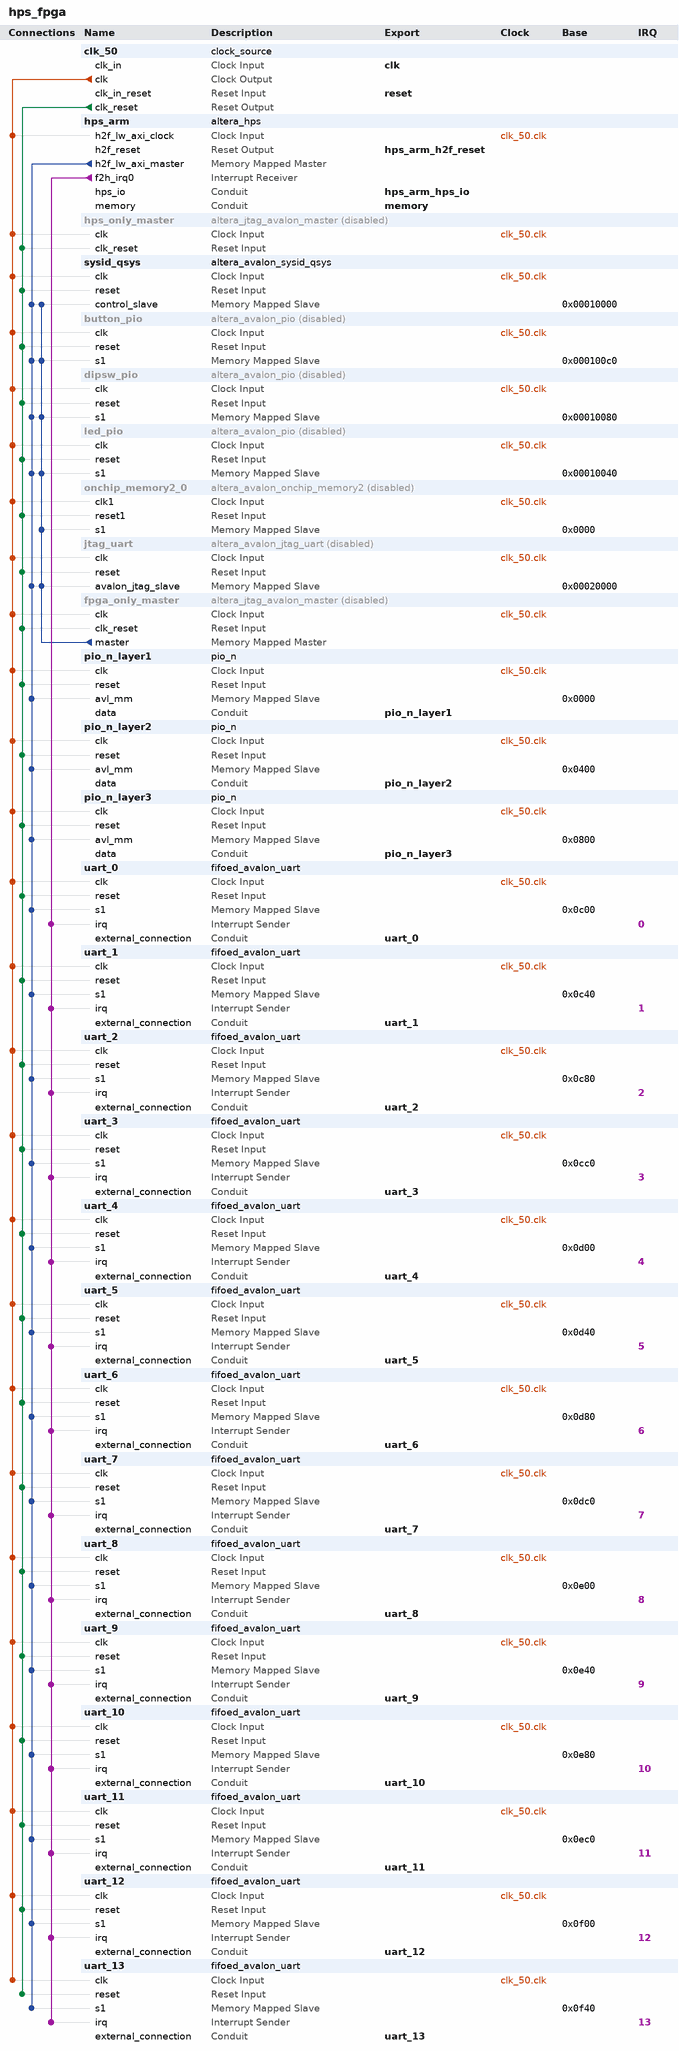
[diagram p0: system contents]
# Platform Designer (Qsys) system hps_fpga, Cyclone V 5CSEBA6U23I7
# Parameters at their usual value, and those the tool derives, are not listed.
package require -exact qsys 16.1
create_system hps_fpga
set_project_property DEVICE_FAMILY {Cyclone V}
set_project_property DEVICE 5CSEBA6U23I7

add_instance clk_50 clock_source 16.1
set_instance_parameter_value clk_50 clockFrequency 50000000

add_instance hps_arm altera_hps 16.1
set_instance_parameter_value hps_arm EMAC1_Mode RGMII
set_instance_parameter_value hps_arm EMAC1_PinMuxing {HPS I/O Set 0}
set_instance_parameter_value hps_arm F2SCLK_COLDRST_Enable false
set_instance_parameter_value hps_arm F2SCLK_DBGRST_Enable false
set_instance_parameter_value hps_arm F2SCLK_WARMRST_Enable false
set_instance_parameter_value hps_arm F2SINTERRUPT_Enable true
set_instance_parameter_value hps_arm F2S_Width 0
set_instance_parameter_value hps_arm FPGA_PERIPHERAL_OUTPUT_CLOCK_FREQ_EMAC0_GTX_CLK 100
set_instance_parameter_value hps_arm FPGA_PERIPHERAL_OUTPUT_CLOCK_FREQ_EMAC0_MD_CLK 100.0
set_instance_parameter_value hps_arm FPGA_PERIPHERAL_OUTPUT_CLOCK_FREQ_EMAC1_GTX_CLK 100
set_instance_parameter_value hps_arm FPGA_PERIPHERAL_OUTPUT_CLOCK_FREQ_EMAC1_MD_CLK 100.0
set_instance_parameter_value hps_arm HPS_PROTOCOL DDR3
set_instance_parameter_value hps_arm I2C0_Mode I2C
set_instance_parameter_value hps_arm I2C0_PinMuxing {HPS I/O Set 0}
set_instance_parameter_value hps_arm I2C1_Mode I2C
set_instance_parameter_value hps_arm I2C1_PinMuxing {HPS I/O Set 0}
set_instance_parameter_value hps_arm LWH2F_Enable true
set_instance_parameter_value hps_arm MEM_BANKADDR_WIDTH 3
set_instance_parameter_value hps_arm MEM_CLK_FREQ 400.0
set_instance_parameter_value hps_arm MEM_COL_ADDR_WIDTH 10
set_instance_parameter_value hps_arm MEM_DQ_WIDTH 32
set_instance_parameter_value hps_arm MEM_DRV_STR RZQ/6
set_instance_parameter_value hps_arm MEM_ROW_ADDR_WIDTH 15
set_instance_parameter_value hps_arm MEM_RTT_NOM RZQ/6
set_instance_parameter_value hps_arm MEM_RTT_WR {Dynamic ODT off}
set_instance_parameter_value hps_arm MEM_TCL 7
set_instance_parameter_value hps_arm MEM_TFAW_NS 37.5
set_instance_parameter_value hps_arm MEM_TRAS_NS 35.0
set_instance_parameter_value hps_arm MEM_TRCD_NS 13.75
set_instance_parameter_value hps_arm MEM_TRFC_NS 300.0
set_instance_parameter_value hps_arm MEM_TRP_NS 13.75
set_instance_parameter_value hps_arm MEM_VENDOR Other
set_instance_parameter_value hps_arm MEM_WTCL 7
set_instance_parameter_value hps_arm QSPI_Mode N/A
set_instance_parameter_value hps_arm QSPI_PinMuxing Unused
set_instance_parameter_value hps_arm REF_CLK_FREQ 25.0
set_instance_parameter_value hps_arm S2FCLK_USER2CLK 5
set_instance_parameter_value hps_arm S2F_Width 0
set_instance_parameter_value hps_arm SDIO_Mode {4-bit Data}
set_instance_parameter_value hps_arm SDIO_PinMuxing {HPS I/O Set 0}
set_instance_parameter_value hps_arm SPIM1_Mode {Single Slave Select}
set_instance_parameter_value hps_arm SPIM1_PinMuxing {HPS I/O Set 0}
set_instance_parameter_value hps_arm STM_Enable false
set_instance_parameter_value hps_arm TIMING_BOARD_AC_SKEW 0.02
set_instance_parameter_value hps_arm TIMING_BOARD_AC_TO_CK_SKEW 0.0
set_instance_parameter_value hps_arm TIMING_BOARD_DQ_TO_DQS_SKEW 0.0
set_instance_parameter_value hps_arm TIMING_BOARD_MAX_CK_DELAY 0.6
set_instance_parameter_value hps_arm TIMING_BOARD_MAX_DQS_DELAY 0.6
set_instance_parameter_value hps_arm TIMING_BOARD_SKEW_BETWEEN_DQS 0.02
set_instance_parameter_value hps_arm TIMING_BOARD_SKEW_CKDQS_DIMM_MAX 0.01
set_instance_parameter_value hps_arm TIMING_BOARD_SKEW_CKDQS_DIMM_MIN -0.01
set_instance_parameter_value hps_arm TIMING_BOARD_SKEW_WITHIN_DQS 0.02
set_instance_parameter_value hps_arm TIMING_TDH 125
set_instance_parameter_value hps_arm TIMING_TDQSCK 400
set_instance_parameter_value hps_arm TIMING_TDQSQ 120
set_instance_parameter_value hps_arm TIMING_TDS 50
set_instance_parameter_value hps_arm TIMING_TIH 250
set_instance_parameter_value hps_arm TIMING_TIS 175
set_instance_parameter_value hps_arm TIMING_TQSH 0.38
set_instance_parameter_value hps_arm UART0_Mode {No Flow Control}
set_instance_parameter_value hps_arm UART0_PinMuxing {HPS I/O Set 0}
set_instance_parameter_value hps_arm USB1_Mode SDR
set_instance_parameter_value hps_arm USB1_PinMuxing {HPS I/O Set 0}
set_instance_parameter_value hps_arm desired_cfg_clk_mhz 100.0
set_instance_parameter_value hps_arm desired_qspi_clk_mhz 370.0

add_instance hps_only_master altera_jtag_avalon_master 16.1
set_instance_property hps_only_master ENABLED false

add_instance sysid_qsys altera_avalon_sysid_qsys 16.1
set_instance_parameter_value sysid_qsys id -1395322110

add_instance button_pio altera_avalon_pio 16.1
set_instance_property button_pio ENABLED false
set_instance_parameter_value button_pio bitClearingEdgeCapReg true
set_instance_parameter_value button_pio captureEdge true
set_instance_parameter_value button_pio direction Input
set_instance_parameter_value button_pio edgeType FALLING
set_instance_parameter_value button_pio generateIRQ true
set_instance_parameter_value button_pio irqType EDGE
set_instance_parameter_value button_pio width 4

add_instance dipsw_pio altera_avalon_pio 16.1
set_instance_property dipsw_pio ENABLED false
set_instance_parameter_value dipsw_pio bitClearingEdgeCapReg true
set_instance_parameter_value dipsw_pio captureEdge true
set_instance_parameter_value dipsw_pio direction Input
set_instance_parameter_value dipsw_pio edgeType ANY
set_instance_parameter_value dipsw_pio generateIRQ true
set_instance_parameter_value dipsw_pio irqType EDGE
set_instance_parameter_value dipsw_pio width 4

add_instance led_pio altera_avalon_pio 16.1
set_instance_property led_pio ENABLED false
set_instance_parameter_value led_pio direction Output
set_instance_parameter_value led_pio width 8

add_instance onchip_memory2_0 altera_avalon_onchip_memory2 16.1
set_instance_property onchip_memory2_0 ENABLED false
set_instance_parameter_value onchip_memory2_0 dataWidth 64
set_instance_parameter_value onchip_memory2_0 dualPort false
set_instance_parameter_value onchip_memory2_0 initMemContent true
set_instance_parameter_value onchip_memory2_0 initializationFileName onchip_memory2_0
set_instance_parameter_value onchip_memory2_0 memorySize 64

add_instance jtag_uart altera_avalon_jtag_uart 16.1
set_instance_property jtag_uart ENABLED false
set_instance_parameter_value jtag_uart allowMultipleConnections true
set_instance_parameter_value jtag_uart simInteractiveOptions INTERACTIVE_ASCII_OUTPUT

add_instance fpga_only_master altera_jtag_avalon_master 16.1
set_instance_property fpga_only_master ENABLED false

add_instance pio_n_layer1 pio_n 1.0
set_instance_parameter_value pio_n_layer1 ByteEnable false
set_instance_parameter_value pio_n_layer1 RegCnt 64

add_instance pio_n_layer2 pio_n 1.0
set_instance_parameter_value pio_n_layer2 ByteEnable false
set_instance_parameter_value pio_n_layer2 RegCnt 64

add_instance pio_n_layer3 pio_n 1.0
set_instance_parameter_value pio_n_layer3 ByteEnable false
set_instance_parameter_value pio_n_layer3 RegCnt 64

add_instance uart_0 fifoed_avalon_uart 13.2
set_instance_parameter_value uart_0 add_error_bits false
set_instance_parameter_value uart_0 baud 115200
set_instance_parameter_value uart_0 dataBits 8
set_instance_parameter_value uart_0 driver_pass_error_bits false
set_instance_parameter_value uart_0 export_handshake false
set_instance_parameter_value uart_0 fifo_export_used false
set_instance_parameter_value uart_0 fifo_size_rx 32
set_instance_parameter_value uart_0 fifo_size_tx 8
set_instance_parameter_value uart_0 fixedBaud false
set_instance_parameter_value uart_0 gap_value 4
set_instance_parameter_value uart_0 hw_cts false
set_instance_parameter_value uart_0 parity NONE
set_instance_parameter_value uart_0 rx_IRQ_Threshold 1
set_instance_parameter_value uart_0 rx_fifo_LE false
set_instance_parameter_value uart_0 simInteractiveInputEnable false
set_instance_parameter_value uart_0 simInteractiveOutputEnable false
set_instance_parameter_value uart_0 simTrueBaud false
set_instance_parameter_value uart_0 stopBits 1
set_instance_parameter_value uart_0 syncRegDepth 2
set_instance_parameter_value uart_0 timeout_value 4
set_instance_parameter_value uart_0 timestamp_width 8
set_instance_parameter_value uart_0 trans_pin false
set_instance_parameter_value uart_0 tx_IRQ_Threshold 1
set_instance_parameter_value uart_0 tx_fifo_LE false
set_instance_parameter_value uart_0 useCtsRts false
set_instance_parameter_value uart_0 useEopRegister false
set_instance_parameter_value uart_0 useRelativePathForSimFile false
set_instance_parameter_value uart_0 use_ext_timestamp false
set_instance_parameter_value uart_0 use_gap_detection false
set_instance_parameter_value uart_0 use_rx_fifo true
set_instance_parameter_value uart_0 use_status_bit_clear false
set_instance_parameter_value uart_0 use_timestamp false
set_instance_parameter_value uart_0 use_timout false
set_instance_parameter_value uart_0 use_tx_fifo false

add_instance uart_1 fifoed_avalon_uart 13.2
set_instance_parameter_value uart_1 add_error_bits false
set_instance_parameter_value uart_1 baud 115200
set_instance_parameter_value uart_1 dataBits 8
set_instance_parameter_value uart_1 driver_pass_error_bits false
set_instance_parameter_value uart_1 export_handshake false
set_instance_parameter_value uart_1 fifo_export_used false
set_instance_parameter_value uart_1 fifo_size_rx 32
set_instance_parameter_value uart_1 fifo_size_tx 8
set_instance_parameter_value uart_1 fixedBaud false
set_instance_parameter_value uart_1 gap_value 4
set_instance_parameter_value uart_1 hw_cts false
set_instance_parameter_value uart_1 parity NONE
set_instance_parameter_value uart_1 rx_IRQ_Threshold 1
set_instance_parameter_value uart_1 rx_fifo_LE false
set_instance_parameter_value uart_1 simInteractiveInputEnable false
set_instance_parameter_value uart_1 simInteractiveOutputEnable false
set_instance_parameter_value uart_1 simTrueBaud false
set_instance_parameter_value uart_1 stopBits 1
set_instance_parameter_value uart_1 syncRegDepth 2
set_instance_parameter_value uart_1 timeout_value 4
set_instance_parameter_value uart_1 timestamp_width 8
set_instance_parameter_value uart_1 trans_pin false
set_instance_parameter_value uart_1 tx_IRQ_Threshold 1
set_instance_parameter_value uart_1 tx_fifo_LE false
set_instance_parameter_value uart_1 useCtsRts false
set_instance_parameter_value uart_1 useEopRegister false
set_instance_parameter_value uart_1 useRelativePathForSimFile false
set_instance_parameter_value uart_1 use_ext_timestamp false
set_instance_parameter_value uart_1 use_gap_detection false
set_instance_parameter_value uart_1 use_rx_fifo true
set_instance_parameter_value uart_1 use_status_bit_clear false
set_instance_parameter_value uart_1 use_timestamp false
set_instance_parameter_value uart_1 use_timout false
set_instance_parameter_value uart_1 use_tx_fifo false

add_instance uart_2 fifoed_avalon_uart 13.2
set_instance_parameter_value uart_2 add_error_bits false
set_instance_parameter_value uart_2 baud 115200
set_instance_parameter_value uart_2 dataBits 8
set_instance_parameter_value uart_2 driver_pass_error_bits false
set_instance_parameter_value uart_2 export_handshake false
set_instance_parameter_value uart_2 fifo_export_used false
set_instance_parameter_value uart_2 fifo_size_rx 32
set_instance_parameter_value uart_2 fifo_size_tx 8
set_instance_parameter_value uart_2 fixedBaud false
set_instance_parameter_value uart_2 gap_value 4
set_instance_parameter_value uart_2 hw_cts false
set_instance_parameter_value uart_2 parity NONE
set_instance_parameter_value uart_2 rx_IRQ_Threshold 1
set_instance_parameter_value uart_2 rx_fifo_LE false
set_instance_parameter_value uart_2 simInteractiveInputEnable false
set_instance_parameter_value uart_2 simInteractiveOutputEnable false
set_instance_parameter_value uart_2 simTrueBaud false
set_instance_parameter_value uart_2 stopBits 1
set_instance_parameter_value uart_2 syncRegDepth 2
set_instance_parameter_value uart_2 timeout_value 4
set_instance_parameter_value uart_2 timestamp_width 8
set_instance_parameter_value uart_2 trans_pin false
set_instance_parameter_value uart_2 tx_IRQ_Threshold 1
set_instance_parameter_value uart_2 tx_fifo_LE false
set_instance_parameter_value uart_2 useCtsRts false
set_instance_parameter_value uart_2 useEopRegister false
set_instance_parameter_value uart_2 useRelativePathForSimFile false
set_instance_parameter_value uart_2 use_ext_timestamp false
set_instance_parameter_value uart_2 use_gap_detection false
set_instance_parameter_value uart_2 use_rx_fifo true
set_instance_parameter_value uart_2 use_status_bit_clear false
set_instance_parameter_value uart_2 use_timestamp false
set_instance_parameter_value uart_2 use_timout false
set_instance_parameter_value uart_2 use_tx_fifo false

add_instance uart_3 fifoed_avalon_uart 13.2
set_instance_parameter_value uart_3 add_error_bits false
set_instance_parameter_value uart_3 baud 115200
set_instance_parameter_value uart_3 dataBits 8
set_instance_parameter_value uart_3 driver_pass_error_bits false
set_instance_parameter_value uart_3 export_handshake false
set_instance_parameter_value uart_3 fifo_export_used false
set_instance_parameter_value uart_3 fifo_size_rx 32
set_instance_parameter_value uart_3 fifo_size_tx 8
set_instance_parameter_value uart_3 fixedBaud false
set_instance_parameter_value uart_3 gap_value 4
set_instance_parameter_value uart_3 hw_cts false
set_instance_parameter_value uart_3 parity NONE
set_instance_parameter_value uart_3 rx_IRQ_Threshold 1
set_instance_parameter_value uart_3 rx_fifo_LE false
set_instance_parameter_value uart_3 simInteractiveInputEnable false
set_instance_parameter_value uart_3 simInteractiveOutputEnable false
set_instance_parameter_value uart_3 simTrueBaud false
set_instance_parameter_value uart_3 stopBits 1
set_instance_parameter_value uart_3 syncRegDepth 2
set_instance_parameter_value uart_3 timeout_value 4
set_instance_parameter_value uart_3 timestamp_width 8
set_instance_parameter_value uart_3 trans_pin false
set_instance_parameter_value uart_3 tx_IRQ_Threshold 1
set_instance_parameter_value uart_3 tx_fifo_LE false
set_instance_parameter_value uart_3 useCtsRts false
set_instance_parameter_value uart_3 useEopRegister false
set_instance_parameter_value uart_3 useRelativePathForSimFile false
set_instance_parameter_value uart_3 use_ext_timestamp false
set_instance_parameter_value uart_3 use_gap_detection false
set_instance_parameter_value uart_3 use_rx_fifo true
set_instance_parameter_value uart_3 use_status_bit_clear false
set_instance_parameter_value uart_3 use_timestamp false
set_instance_parameter_value uart_3 use_timout false
set_instance_parameter_value uart_3 use_tx_fifo false

add_instance uart_4 fifoed_avalon_uart 13.2
set_instance_parameter_value uart_4 add_error_bits false
set_instance_parameter_value uart_4 baud 115200
set_instance_parameter_value uart_4 dataBits 8
set_instance_parameter_value uart_4 driver_pass_error_bits false
set_instance_parameter_value uart_4 export_handshake false
set_instance_parameter_value uart_4 fifo_export_used false
set_instance_parameter_value uart_4 fifo_size_rx 32
set_instance_parameter_value uart_4 fifo_size_tx 8
set_instance_parameter_value uart_4 fixedBaud false
set_instance_parameter_value uart_4 gap_value 4
set_instance_parameter_value uart_4 hw_cts false
set_instance_parameter_value uart_4 parity NONE
set_instance_parameter_value uart_4 rx_IRQ_Threshold 1
set_instance_parameter_value uart_4 rx_fifo_LE false
set_instance_parameter_value uart_4 simInteractiveInputEnable false
set_instance_parameter_value uart_4 simInteractiveOutputEnable false
set_instance_parameter_value uart_4 simTrueBaud false
set_instance_parameter_value uart_4 stopBits 1
set_instance_parameter_value uart_4 syncRegDepth 2
set_instance_parameter_value uart_4 timeout_value 4
set_instance_parameter_value uart_4 timestamp_width 8
set_instance_parameter_value uart_4 trans_pin false
set_instance_parameter_value uart_4 tx_IRQ_Threshold 1
set_instance_parameter_value uart_4 tx_fifo_LE false
set_instance_parameter_value uart_4 useCtsRts false
set_instance_parameter_value uart_4 useEopRegister false
set_instance_parameter_value uart_4 useRelativePathForSimFile false
set_instance_parameter_value uart_4 use_ext_timestamp false
set_instance_parameter_value uart_4 use_gap_detection false
set_instance_parameter_value uart_4 use_rx_fifo true
set_instance_parameter_value uart_4 use_status_bit_clear false
set_instance_parameter_value uart_4 use_timestamp false
set_instance_parameter_value uart_4 use_timout false
set_instance_parameter_value uart_4 use_tx_fifo false

add_instance uart_5 fifoed_avalon_uart 13.2
set_instance_parameter_value uart_5 add_error_bits false
set_instance_parameter_value uart_5 baud 115200
set_instance_parameter_value uart_5 dataBits 8
set_instance_parameter_value uart_5 driver_pass_error_bits false
set_instance_parameter_value uart_5 export_handshake false
set_instance_parameter_value uart_5 fifo_export_used false
set_instance_parameter_value uart_5 fifo_size_rx 32
set_instance_parameter_value uart_5 fifo_size_tx 8
set_instance_parameter_value uart_5 fixedBaud false
set_instance_parameter_value uart_5 gap_value 4
set_instance_parameter_value uart_5 hw_cts false
set_instance_parameter_value uart_5 parity NONE
set_instance_parameter_value uart_5 rx_IRQ_Threshold 1
set_instance_parameter_value uart_5 rx_fifo_LE false
set_instance_parameter_value uart_5 simInteractiveInputEnable false
set_instance_parameter_value uart_5 simInteractiveOutputEnable false
set_instance_parameter_value uart_5 simTrueBaud false
set_instance_parameter_value uart_5 stopBits 1
set_instance_parameter_value uart_5 syncRegDepth 2
set_instance_parameter_value uart_5 timeout_value 4
set_instance_parameter_value uart_5 timestamp_width 8
set_instance_parameter_value uart_5 trans_pin false
set_instance_parameter_value uart_5 tx_IRQ_Threshold 1
set_instance_parameter_value uart_5 tx_fifo_LE false
set_instance_parameter_value uart_5 useCtsRts false
set_instance_parameter_value uart_5 useEopRegister false
set_instance_parameter_value uart_5 useRelativePathForSimFile false
set_instance_parameter_value uart_5 use_ext_timestamp false
set_instance_parameter_value uart_5 use_gap_detection false
set_instance_parameter_value uart_5 use_rx_fifo true
set_instance_parameter_value uart_5 use_status_bit_clear false
set_instance_parameter_value uart_5 use_timestamp false
set_instance_parameter_value uart_5 use_timout false
set_instance_parameter_value uart_5 use_tx_fifo false

add_instance uart_6 fifoed_avalon_uart 13.2
set_instance_parameter_value uart_6 add_error_bits false
set_instance_parameter_value uart_6 baud 115200
set_instance_parameter_value uart_6 dataBits 8
set_instance_parameter_value uart_6 driver_pass_error_bits false
set_instance_parameter_value uart_6 export_handshake false
set_instance_parameter_value uart_6 fifo_export_used false
set_instance_parameter_value uart_6 fifo_size_rx 32
set_instance_parameter_value uart_6 fifo_size_tx 8
set_instance_parameter_value uart_6 fixedBaud false
set_instance_parameter_value uart_6 gap_value 4
set_instance_parameter_value uart_6 hw_cts false
set_instance_parameter_value uart_6 parity NONE
set_instance_parameter_value uart_6 rx_IRQ_Threshold 1
set_instance_parameter_value uart_6 rx_fifo_LE false
set_instance_parameter_value uart_6 simInteractiveInputEnable false
set_instance_parameter_value uart_6 simInteractiveOutputEnable false
set_instance_parameter_value uart_6 simTrueBaud false
set_instance_parameter_value uart_6 stopBits 1
set_instance_parameter_value uart_6 syncRegDepth 2
set_instance_parameter_value uart_6 timeout_value 4
set_instance_parameter_value uart_6 timestamp_width 8
set_instance_parameter_value uart_6 trans_pin false
set_instance_parameter_value uart_6 tx_IRQ_Threshold 1
set_instance_parameter_value uart_6 tx_fifo_LE false
set_instance_parameter_value uart_6 useCtsRts false
set_instance_parameter_value uart_6 useEopRegister false
set_instance_parameter_value uart_6 useRelativePathForSimFile false
set_instance_parameter_value uart_6 use_ext_timestamp false
set_instance_parameter_value uart_6 use_gap_detection false
set_instance_parameter_value uart_6 use_rx_fifo true
set_instance_parameter_value uart_6 use_status_bit_clear false
set_instance_parameter_value uart_6 use_timestamp false
set_instance_parameter_value uart_6 use_timout false
set_instance_parameter_value uart_6 use_tx_fifo false

add_instance uart_7 fifoed_avalon_uart 13.2
set_instance_parameter_value uart_7 add_error_bits false
set_instance_parameter_value uart_7 baud 115200
set_instance_parameter_value uart_7 dataBits 8
set_instance_parameter_value uart_7 driver_pass_error_bits false
set_instance_parameter_value uart_7 export_handshake false
set_instance_parameter_value uart_7 fifo_export_used false
set_instance_parameter_value uart_7 fifo_size_rx 32
set_instance_parameter_value uart_7 fifo_size_tx 8
set_instance_parameter_value uart_7 fixedBaud false
set_instance_parameter_value uart_7 gap_value 4
set_instance_parameter_value uart_7 hw_cts false
set_instance_parameter_value uart_7 parity NONE
set_instance_parameter_value uart_7 rx_IRQ_Threshold 1
set_instance_parameter_value uart_7 rx_fifo_LE false
set_instance_parameter_value uart_7 simInteractiveInputEnable false
set_instance_parameter_value uart_7 simInteractiveOutputEnable false
set_instance_parameter_value uart_7 simTrueBaud false
set_instance_parameter_value uart_7 stopBits 1
set_instance_parameter_value uart_7 syncRegDepth 2
set_instance_parameter_value uart_7 timeout_value 4
set_instance_parameter_value uart_7 timestamp_width 8
set_instance_parameter_value uart_7 trans_pin false
set_instance_parameter_value uart_7 tx_IRQ_Threshold 1
set_instance_parameter_value uart_7 tx_fifo_LE false
set_instance_parameter_value uart_7 useCtsRts false
set_instance_parameter_value uart_7 useEopRegister false
set_instance_parameter_value uart_7 useRelativePathForSimFile false
set_instance_parameter_value uart_7 use_ext_timestamp false
set_instance_parameter_value uart_7 use_gap_detection false
set_instance_parameter_value uart_7 use_rx_fifo true
set_instance_parameter_value uart_7 use_status_bit_clear false
set_instance_parameter_value uart_7 use_timestamp false
set_instance_parameter_value uart_7 use_timout false
set_instance_parameter_value uart_7 use_tx_fifo false

add_instance uart_8 fifoed_avalon_uart 13.2
set_instance_parameter_value uart_8 add_error_bits false
set_instance_parameter_value uart_8 baud 115200
set_instance_parameter_value uart_8 dataBits 8
set_instance_parameter_value uart_8 driver_pass_error_bits false
set_instance_parameter_value uart_8 export_handshake false
set_instance_parameter_value uart_8 fifo_export_used false
set_instance_parameter_value uart_8 fifo_size_rx 32
set_instance_parameter_value uart_8 fifo_size_tx 8
set_instance_parameter_value uart_8 fixedBaud false
set_instance_parameter_value uart_8 gap_value 4
set_instance_parameter_value uart_8 hw_cts false
set_instance_parameter_value uart_8 parity NONE
set_instance_parameter_value uart_8 rx_IRQ_Threshold 1
set_instance_parameter_value uart_8 rx_fifo_LE false
set_instance_parameter_value uart_8 simInteractiveInputEnable false
set_instance_parameter_value uart_8 simInteractiveOutputEnable false
set_instance_parameter_value uart_8 simTrueBaud false
set_instance_parameter_value uart_8 stopBits 1
set_instance_parameter_value uart_8 syncRegDepth 2
set_instance_parameter_value uart_8 timeout_value 4
set_instance_parameter_value uart_8 timestamp_width 8
set_instance_parameter_value uart_8 trans_pin false
set_instance_parameter_value uart_8 tx_IRQ_Threshold 1
set_instance_parameter_value uart_8 tx_fifo_LE false
set_instance_parameter_value uart_8 useCtsRts false
set_instance_parameter_value uart_8 useEopRegister false
set_instance_parameter_value uart_8 useRelativePathForSimFile false
set_instance_parameter_value uart_8 use_ext_timestamp false
set_instance_parameter_value uart_8 use_gap_detection false
set_instance_parameter_value uart_8 use_rx_fifo true
set_instance_parameter_value uart_8 use_status_bit_clear false
set_instance_parameter_value uart_8 use_timestamp false
set_instance_parameter_value uart_8 use_timout false
set_instance_parameter_value uart_8 use_tx_fifo false

add_instance uart_9 fifoed_avalon_uart 13.2
set_instance_parameter_value uart_9 add_error_bits false
set_instance_parameter_value uart_9 baud 115200
set_instance_parameter_value uart_9 dataBits 8
set_instance_parameter_value uart_9 driver_pass_error_bits false
set_instance_parameter_value uart_9 export_handshake false
set_instance_parameter_value uart_9 fifo_export_used false
set_instance_parameter_value uart_9 fifo_size_rx 32
set_instance_parameter_value uart_9 fifo_size_tx 8
set_instance_parameter_value uart_9 fixedBaud false
set_instance_parameter_value uart_9 gap_value 4
set_instance_parameter_value uart_9 hw_cts false
set_instance_parameter_value uart_9 parity NONE
set_instance_parameter_value uart_9 rx_IRQ_Threshold 1
set_instance_parameter_value uart_9 rx_fifo_LE false
set_instance_parameter_value uart_9 simInteractiveInputEnable false
set_instance_parameter_value uart_9 simInteractiveOutputEnable false
set_instance_parameter_value uart_9 simTrueBaud false
set_instance_parameter_value uart_9 stopBits 1
set_instance_parameter_value uart_9 syncRegDepth 2
set_instance_parameter_value uart_9 timeout_value 4
set_instance_parameter_value uart_9 timestamp_width 8
set_instance_parameter_value uart_9 trans_pin false
set_instance_parameter_value uart_9 tx_IRQ_Threshold 1
set_instance_parameter_value uart_9 tx_fifo_LE false
set_instance_parameter_value uart_9 useCtsRts false
set_instance_parameter_value uart_9 useEopRegister false
set_instance_parameter_value uart_9 useRelativePathForSimFile false
set_instance_parameter_value uart_9 use_ext_timestamp false
set_instance_parameter_value uart_9 use_gap_detection false
set_instance_parameter_value uart_9 use_rx_fifo true
set_instance_parameter_value uart_9 use_status_bit_clear false
set_instance_parameter_value uart_9 use_timestamp false
set_instance_parameter_value uart_9 use_timout false
set_instance_parameter_value uart_9 use_tx_fifo false

add_instance uart_10 fifoed_avalon_uart 13.2
set_instance_parameter_value uart_10 add_error_bits false
set_instance_parameter_value uart_10 baud 115200
set_instance_parameter_value uart_10 dataBits 8
set_instance_parameter_value uart_10 driver_pass_error_bits false
set_instance_parameter_value uart_10 export_handshake false
set_instance_parameter_value uart_10 fifo_export_used false
set_instance_parameter_value uart_10 fifo_size_rx 32
set_instance_parameter_value uart_10 fifo_size_tx 8
set_instance_parameter_value uart_10 fixedBaud false
set_instance_parameter_value uart_10 gap_value 4
set_instance_parameter_value uart_10 hw_cts false
set_instance_parameter_value uart_10 parity NONE
set_instance_parameter_value uart_10 rx_IRQ_Threshold 1
set_instance_parameter_value uart_10 rx_fifo_LE false
set_instance_parameter_value uart_10 simInteractiveInputEnable false
set_instance_parameter_value uart_10 simInteractiveOutputEnable false
set_instance_parameter_value uart_10 simTrueBaud false
set_instance_parameter_value uart_10 stopBits 1
set_instance_parameter_value uart_10 syncRegDepth 2
set_instance_parameter_value uart_10 timeout_value 4
set_instance_parameter_value uart_10 timestamp_width 8
set_instance_parameter_value uart_10 trans_pin false
set_instance_parameter_value uart_10 tx_IRQ_Threshold 1
set_instance_parameter_value uart_10 tx_fifo_LE false
set_instance_parameter_value uart_10 useCtsRts false
set_instance_parameter_value uart_10 useEopRegister false
set_instance_parameter_value uart_10 useRelativePathForSimFile false
set_instance_parameter_value uart_10 use_ext_timestamp false
set_instance_parameter_value uart_10 use_gap_detection false
set_instance_parameter_value uart_10 use_rx_fifo true
set_instance_parameter_value uart_10 use_status_bit_clear false
set_instance_parameter_value uart_10 use_timestamp false
set_instance_parameter_value uart_10 use_timout false
set_instance_parameter_value uart_10 use_tx_fifo false

add_instance uart_11 fifoed_avalon_uart 13.2
set_instance_parameter_value uart_11 add_error_bits false
set_instance_parameter_value uart_11 baud 115200
set_instance_parameter_value uart_11 dataBits 8
set_instance_parameter_value uart_11 driver_pass_error_bits false
set_instance_parameter_value uart_11 export_handshake false
set_instance_parameter_value uart_11 fifo_export_used false
set_instance_parameter_value uart_11 fifo_size_rx 32
set_instance_parameter_value uart_11 fifo_size_tx 8
set_instance_parameter_value uart_11 fixedBaud false
set_instance_parameter_value uart_11 gap_value 4
set_instance_parameter_value uart_11 hw_cts false
set_instance_parameter_value uart_11 parity NONE
set_instance_parameter_value uart_11 rx_IRQ_Threshold 1
set_instance_parameter_value uart_11 rx_fifo_LE false
set_instance_parameter_value uart_11 simInteractiveInputEnable false
set_instance_parameter_value uart_11 simInteractiveOutputEnable false
set_instance_parameter_value uart_11 simTrueBaud false
set_instance_parameter_value uart_11 stopBits 1
set_instance_parameter_value uart_11 syncRegDepth 2
set_instance_parameter_value uart_11 timeout_value 4
set_instance_parameter_value uart_11 timestamp_width 8
set_instance_parameter_value uart_11 trans_pin false
set_instance_parameter_value uart_11 tx_IRQ_Threshold 1
set_instance_parameter_value uart_11 tx_fifo_LE false
set_instance_parameter_value uart_11 useCtsRts false
set_instance_parameter_value uart_11 useEopRegister false
set_instance_parameter_value uart_11 useRelativePathForSimFile false
set_instance_parameter_value uart_11 use_ext_timestamp false
set_instance_parameter_value uart_11 use_gap_detection false
set_instance_parameter_value uart_11 use_rx_fifo true
set_instance_parameter_value uart_11 use_status_bit_clear false
set_instance_parameter_value uart_11 use_timestamp false
set_instance_parameter_value uart_11 use_timout false
set_instance_parameter_value uart_11 use_tx_fifo false

add_instance uart_12 fifoed_avalon_uart 13.2
set_instance_parameter_value uart_12 add_error_bits false
set_instance_parameter_value uart_12 baud 115200
set_instance_parameter_value uart_12 dataBits 8
set_instance_parameter_value uart_12 driver_pass_error_bits false
set_instance_parameter_value uart_12 export_handshake false
set_instance_parameter_value uart_12 fifo_export_used false
set_instance_parameter_value uart_12 fifo_size_rx 32
set_instance_parameter_value uart_12 fifo_size_tx 8
set_instance_parameter_value uart_12 fixedBaud false
set_instance_parameter_value uart_12 gap_value 4
set_instance_parameter_value uart_12 hw_cts false
set_instance_parameter_value uart_12 parity NONE
set_instance_parameter_value uart_12 rx_IRQ_Threshold 1
set_instance_parameter_value uart_12 rx_fifo_LE false
set_instance_parameter_value uart_12 simInteractiveInputEnable false
set_instance_parameter_value uart_12 simInteractiveOutputEnable false
set_instance_parameter_value uart_12 simTrueBaud false
set_instance_parameter_value uart_12 stopBits 1
set_instance_parameter_value uart_12 syncRegDepth 2
set_instance_parameter_value uart_12 timeout_value 4
set_instance_parameter_value uart_12 timestamp_width 8
set_instance_parameter_value uart_12 trans_pin false
set_instance_parameter_value uart_12 tx_IRQ_Threshold 1
set_instance_parameter_value uart_12 tx_fifo_LE false
set_instance_parameter_value uart_12 useCtsRts false
set_instance_parameter_value uart_12 useEopRegister false
set_instance_parameter_value uart_12 useRelativePathForSimFile false
set_instance_parameter_value uart_12 use_ext_timestamp false
set_instance_parameter_value uart_12 use_gap_detection false
set_instance_parameter_value uart_12 use_rx_fifo true
set_instance_parameter_value uart_12 use_status_bit_clear false
set_instance_parameter_value uart_12 use_timestamp false
set_instance_parameter_value uart_12 use_timout false
set_instance_parameter_value uart_12 use_tx_fifo false

add_instance uart_13 fifoed_avalon_uart 13.2
set_instance_parameter_value uart_13 add_error_bits false
set_instance_parameter_value uart_13 baud 115200
set_instance_parameter_value uart_13 dataBits 8
set_instance_parameter_value uart_13 driver_pass_error_bits false
set_instance_parameter_value uart_13 export_handshake false
set_instance_parameter_value uart_13 fifo_export_used false
set_instance_parameter_value uart_13 fifo_size_rx 32
set_instance_parameter_value uart_13 fifo_size_tx 8
set_instance_parameter_value uart_13 fixedBaud false
set_instance_parameter_value uart_13 gap_value 4
set_instance_parameter_value uart_13 hw_cts false
set_instance_parameter_value uart_13 parity NONE
set_instance_parameter_value uart_13 rx_IRQ_Threshold 1
set_instance_parameter_value uart_13 rx_fifo_LE false
set_instance_parameter_value uart_13 simInteractiveInputEnable false
set_instance_parameter_value uart_13 simInteractiveOutputEnable false
set_instance_parameter_value uart_13 simTrueBaud false
set_instance_parameter_value uart_13 stopBits 1
set_instance_parameter_value uart_13 syncRegDepth 2
set_instance_parameter_value uart_13 timeout_value 4
set_instance_parameter_value uart_13 timestamp_width 8
set_instance_parameter_value uart_13 trans_pin false
set_instance_parameter_value uart_13 tx_IRQ_Threshold 1
set_instance_parameter_value uart_13 tx_fifo_LE false
set_instance_parameter_value uart_13 useCtsRts false
set_instance_parameter_value uart_13 useEopRegister false
set_instance_parameter_value uart_13 useRelativePathForSimFile false
set_instance_parameter_value uart_13 use_ext_timestamp false
set_instance_parameter_value uart_13 use_gap_detection false
set_instance_parameter_value uart_13 use_rx_fifo true
set_instance_parameter_value uart_13 use_status_bit_clear false
set_instance_parameter_value uart_13 use_timestamp false
set_instance_parameter_value uart_13 use_timout false
set_instance_parameter_value uart_13 use_tx_fifo false

# connections
add_connection clk_50.clk button_pio.clk clock
add_connection clk_50.clk dipsw_pio.clk clock
add_connection clk_50.clk fpga_only_master.clk clock
add_connection clk_50.clk hps_arm.h2f_lw_axi_clock clock
add_connection clk_50.clk hps_only_master.clk clock
add_connection clk_50.clk jtag_uart.clk clock
add_connection clk_50.clk led_pio.clk clock
add_connection clk_50.clk onchip_memory2_0.clk1 clock
add_connection clk_50.clk pio_n_layer1.clk clock
add_connection clk_50.clk pio_n_layer2.clk clock
add_connection clk_50.clk pio_n_layer3.clk clock
add_connection clk_50.clk sysid_qsys.clk clock
add_connection clk_50.clk uart_0.clk clock
add_connection clk_50.clk uart_1.clk clock
add_connection clk_50.clk uart_2.clk clock
add_connection clk_50.clk uart_3.clk clock
add_connection clk_50.clk uart_4.clk clock
add_connection clk_50.clk uart_5.clk clock
add_connection clk_50.clk uart_6.clk clock
add_connection clk_50.clk uart_7.clk clock
add_connection clk_50.clk uart_8.clk clock
add_connection clk_50.clk uart_9.clk clock
add_connection clk_50.clk uart_10.clk clock
add_connection clk_50.clk uart_11.clk clock
add_connection clk_50.clk uart_12.clk clock
add_connection clk_50.clk uart_13.clk clock
add_connection clk_50.clk_reset button_pio.reset reset
add_connection clk_50.clk_reset dipsw_pio.reset reset
add_connection clk_50.clk_reset fpga_only_master.clk_reset reset
add_connection clk_50.clk_reset hps_only_master.clk_reset reset
add_connection clk_50.clk_reset jtag_uart.reset reset
add_connection clk_50.clk_reset led_pio.reset reset
add_connection clk_50.clk_reset onchip_memory2_0.reset1 reset
add_connection clk_50.clk_reset pio_n_layer1.reset reset
add_connection clk_50.clk_reset pio_n_layer2.reset reset
add_connection clk_50.clk_reset pio_n_layer3.reset reset
add_connection clk_50.clk_reset sysid_qsys.reset reset
add_connection clk_50.clk_reset uart_0.reset reset
add_connection clk_50.clk_reset uart_1.reset reset
add_connection clk_50.clk_reset uart_2.reset reset
add_connection clk_50.clk_reset uart_3.reset reset
add_connection clk_50.clk_reset uart_4.reset reset
add_connection clk_50.clk_reset uart_5.reset reset
add_connection clk_50.clk_reset uart_6.reset reset
add_connection clk_50.clk_reset uart_7.reset reset
add_connection clk_50.clk_reset uart_8.reset reset
add_connection clk_50.clk_reset uart_9.reset reset
add_connection clk_50.clk_reset uart_10.reset reset
add_connection clk_50.clk_reset uart_11.reset reset
add_connection clk_50.clk_reset uart_12.reset reset
add_connection clk_50.clk_reset uart_13.reset reset
add_connection fpga_only_master.master button_pio.s1 avalon
set_connection_parameter_value fpga_only_master.master/button_pio.s1 baseAddress 0x000100c0
add_connection fpga_only_master.master dipsw_pio.s1 avalon
set_connection_parameter_value fpga_only_master.master/dipsw_pio.s1 baseAddress 0x00010080
add_connection fpga_only_master.master jtag_uart.avalon_jtag_slave avalon
set_connection_parameter_value fpga_only_master.master/jtag_uart.avalon_jtag_slave baseAddress 0x00020000
add_connection fpga_only_master.master led_pio.s1 avalon
set_connection_parameter_value fpga_only_master.master/led_pio.s1 baseAddress 0x00010040
add_connection fpga_only_master.master onchip_memory2_0.s1 avalon
set_connection_parameter_value fpga_only_master.master/onchip_memory2_0.s1 baseAddress 0x0000
add_connection fpga_only_master.master sysid_qsys.control_slave avalon
set_connection_parameter_value fpga_only_master.master/sysid_qsys.control_slave baseAddress 0x00010000
add_connection hps_arm.h2f_lw_axi_master button_pio.s1 avalon
set_connection_parameter_value hps_arm.h2f_lw_axi_master/button_pio.s1 baseAddress 0x000100c0
add_connection hps_arm.h2f_lw_axi_master dipsw_pio.s1 avalon
set_connection_parameter_value hps_arm.h2f_lw_axi_master/dipsw_pio.s1 baseAddress 0x00010080
add_connection hps_arm.h2f_lw_axi_master jtag_uart.avalon_jtag_slave avalon
set_connection_parameter_value hps_arm.h2f_lw_axi_master/jtag_uart.avalon_jtag_slave baseAddress 0x00020000
add_connection hps_arm.h2f_lw_axi_master led_pio.s1 avalon
set_connection_parameter_value hps_arm.h2f_lw_axi_master/led_pio.s1 baseAddress 0x00010040
add_connection hps_arm.h2f_lw_axi_master pio_n_layer1.avl_mm avalon
set_connection_parameter_value hps_arm.h2f_lw_axi_master/pio_n_layer1.avl_mm baseAddress 0x0000
add_connection hps_arm.h2f_lw_axi_master pio_n_layer2.avl_mm avalon
set_connection_parameter_value hps_arm.h2f_lw_axi_master/pio_n_layer2.avl_mm baseAddress 0x0400
add_connection hps_arm.h2f_lw_axi_master pio_n_layer3.avl_mm avalon
set_connection_parameter_value hps_arm.h2f_lw_axi_master/pio_n_layer3.avl_mm baseAddress 0x0800
add_connection hps_arm.h2f_lw_axi_master sysid_qsys.control_slave avalon
set_connection_parameter_value hps_arm.h2f_lw_axi_master/sysid_qsys.control_slave baseAddress 0x00010000
add_connection hps_arm.h2f_lw_axi_master uart_0.s1 avalon
set_connection_parameter_value hps_arm.h2f_lw_axi_master/uart_0.s1 baseAddress 0x0c00
add_connection hps_arm.h2f_lw_axi_master uart_1.s1 avalon
set_connection_parameter_value hps_arm.h2f_lw_axi_master/uart_1.s1 baseAddress 0x0c40
add_connection hps_arm.h2f_lw_axi_master uart_2.s1 avalon
set_connection_parameter_value hps_arm.h2f_lw_axi_master/uart_2.s1 baseAddress 0x0c80
add_connection hps_arm.h2f_lw_axi_master uart_3.s1 avalon
set_connection_parameter_value hps_arm.h2f_lw_axi_master/uart_3.s1 baseAddress 0x0cc0
add_connection hps_arm.h2f_lw_axi_master uart_4.s1 avalon
set_connection_parameter_value hps_arm.h2f_lw_axi_master/uart_4.s1 baseAddress 0x0d00
add_connection hps_arm.h2f_lw_axi_master uart_5.s1 avalon
set_connection_parameter_value hps_arm.h2f_lw_axi_master/uart_5.s1 baseAddress 0x0d40
add_connection hps_arm.h2f_lw_axi_master uart_6.s1 avalon
set_connection_parameter_value hps_arm.h2f_lw_axi_master/uart_6.s1 baseAddress 0x0d80
add_connection hps_arm.h2f_lw_axi_master uart_7.s1 avalon
set_connection_parameter_value hps_arm.h2f_lw_axi_master/uart_7.s1 baseAddress 0x0dc0
add_connection hps_arm.h2f_lw_axi_master uart_8.s1 avalon
set_connection_parameter_value hps_arm.h2f_lw_axi_master/uart_8.s1 baseAddress 0x0e00
add_connection hps_arm.h2f_lw_axi_master uart_9.s1 avalon
set_connection_parameter_value hps_arm.h2f_lw_axi_master/uart_9.s1 baseAddress 0x0e40
add_connection hps_arm.h2f_lw_axi_master uart_10.s1 avalon
set_connection_parameter_value hps_arm.h2f_lw_axi_master/uart_10.s1 baseAddress 0x0e80
add_connection hps_arm.h2f_lw_axi_master uart_11.s1 avalon
set_connection_parameter_value hps_arm.h2f_lw_axi_master/uart_11.s1 baseAddress 0x0ec0
add_connection hps_arm.h2f_lw_axi_master uart_12.s1 avalon
set_connection_parameter_value hps_arm.h2f_lw_axi_master/uart_12.s1 baseAddress 0x0f00
add_connection hps_arm.h2f_lw_axi_master uart_13.s1 avalon
set_connection_parameter_value hps_arm.h2f_lw_axi_master/uart_13.s1 baseAddress 0x0f40
add_connection hps_arm.f2h_irq0 uart_0.irq interrupt
set_connection_parameter_value hps_arm.f2h_irq0/uart_0.irq irqNumber 0
add_connection hps_arm.f2h_irq0 uart_1.irq interrupt
set_connection_parameter_value hps_arm.f2h_irq0/uart_1.irq irqNumber 1
add_connection hps_arm.f2h_irq0 uart_2.irq interrupt
set_connection_parameter_value hps_arm.f2h_irq0/uart_2.irq irqNumber 2
add_connection hps_arm.f2h_irq0 uart_3.irq interrupt
set_connection_parameter_value hps_arm.f2h_irq0/uart_3.irq irqNumber 3
add_connection hps_arm.f2h_irq0 uart_4.irq interrupt
set_connection_parameter_value hps_arm.f2h_irq0/uart_4.irq irqNumber 4
add_connection hps_arm.f2h_irq0 uart_5.irq interrupt
set_connection_parameter_value hps_arm.f2h_irq0/uart_5.irq irqNumber 5
add_connection hps_arm.f2h_irq0 uart_6.irq interrupt
set_connection_parameter_value hps_arm.f2h_irq0/uart_6.irq irqNumber 6
add_connection hps_arm.f2h_irq0 uart_7.irq interrupt
set_connection_parameter_value hps_arm.f2h_irq0/uart_7.irq irqNumber 7
add_connection hps_arm.f2h_irq0 uart_8.irq interrupt
set_connection_parameter_value hps_arm.f2h_irq0/uart_8.irq irqNumber 8
add_connection hps_arm.f2h_irq0 uart_9.irq interrupt
set_connection_parameter_value hps_arm.f2h_irq0/uart_9.irq irqNumber 9
add_connection hps_arm.f2h_irq0 uart_10.irq interrupt
set_connection_parameter_value hps_arm.f2h_irq0/uart_10.irq irqNumber 10
add_connection hps_arm.f2h_irq0 uart_11.irq interrupt
set_connection_parameter_value hps_arm.f2h_irq0/uart_11.irq irqNumber 11
add_connection hps_arm.f2h_irq0 uart_12.irq interrupt
set_connection_parameter_value hps_arm.f2h_irq0/uart_12.irq irqNumber 12
add_connection hps_arm.f2h_irq0 uart_13.irq interrupt
set_connection_parameter_value hps_arm.f2h_irq0/uart_13.irq irqNumber 13

# exported interfaces
add_interface clk clock sink
set_interface_property clk EXPORT_OF clk_50.clk_in
add_interface hps_arm_h2f_reset reset source
set_interface_property hps_arm_h2f_reset EXPORT_OF hps_arm.h2f_reset
add_interface hps_arm_hps_io conduit end
set_interface_property hps_arm_hps_io EXPORT_OF hps_arm.hps_io
add_interface memory conduit end
set_interface_property memory EXPORT_OF hps_arm.memory
add_interface pio_n_layer1 conduit end
set_interface_property pio_n_layer1 EXPORT_OF pio_n_layer1.data
add_interface pio_n_layer2 conduit end
set_interface_property pio_n_layer2 EXPORT_OF pio_n_layer2.data
add_interface pio_n_layer3 conduit end
set_interface_property pio_n_layer3 EXPORT_OF pio_n_layer3.data
add_interface reset reset sink
set_interface_property reset EXPORT_OF clk_50.clk_in_reset
add_interface uart_0 conduit end
set_interface_property uart_0 EXPORT_OF uart_0.external_connection
add_interface uart_1 conduit end
set_interface_property uart_1 EXPORT_OF uart_1.external_connection
add_interface uart_10 conduit end
set_interface_property uart_10 EXPORT_OF uart_10.external_connection
add_interface uart_11 conduit end
set_interface_property uart_11 EXPORT_OF uart_11.external_connection
add_interface uart_12 conduit end
set_interface_property uart_12 EXPORT_OF uart_12.external_connection
add_interface uart_13 conduit end
set_interface_property uart_13 EXPORT_OF uart_13.external_connection
add_interface uart_2 conduit end
set_interface_property uart_2 EXPORT_OF uart_2.external_connection
add_interface uart_3 conduit end
set_interface_property uart_3 EXPORT_OF uart_3.external_connection
add_interface uart_4 conduit end
set_interface_property uart_4 EXPORT_OF uart_4.external_connection
add_interface uart_5 conduit end
set_interface_property uart_5 EXPORT_OF uart_5.external_connection
add_interface uart_6 conduit end
set_interface_property uart_6 EXPORT_OF uart_6.external_connection
add_interface uart_7 conduit end
set_interface_property uart_7 EXPORT_OF uart_7.external_connection
add_interface uart_8 conduit end
set_interface_property uart_8 EXPORT_OF uart_8.external_connection
add_interface uart_9 conduit end
set_interface_property uart_9 EXPORT_OF uart_9.external_connection

set_interconnect_requirement {$system} qsys_mm.clockCrossingAdapter HANDSHAKE
set_interconnect_requirement {$system} qsys_mm.maxAdditionalLatency 1

save_system hps_fpga.qsys
